# Altium schematic sheet 3_P3.schdoc
size 307 x 218 mm; Symbol: Drawing-Symbol_A4; Device: Drawing-Symbol_A4; Company: 嘉立创EDA; Version: V1.0; Page Size: A4; @Project Name: TUSB4020BPHP; @Page Count: 2; @Update Date: 2025-04-17; @Create Date: 2025-04-13; @Schematic Name: Schematic1; @Page No: 2; @Page Name: P2; @Create Time: 01:15:57; @Update Time: 21:07:25; Width: 1170; Height: 825; Region Start: 1; X Region Count: 6; Y Region Count: 4; Blade Width: 10; Title Block Position: 3; @Board Name: Board1; SheetNumber: 3; SheetTotal: 3
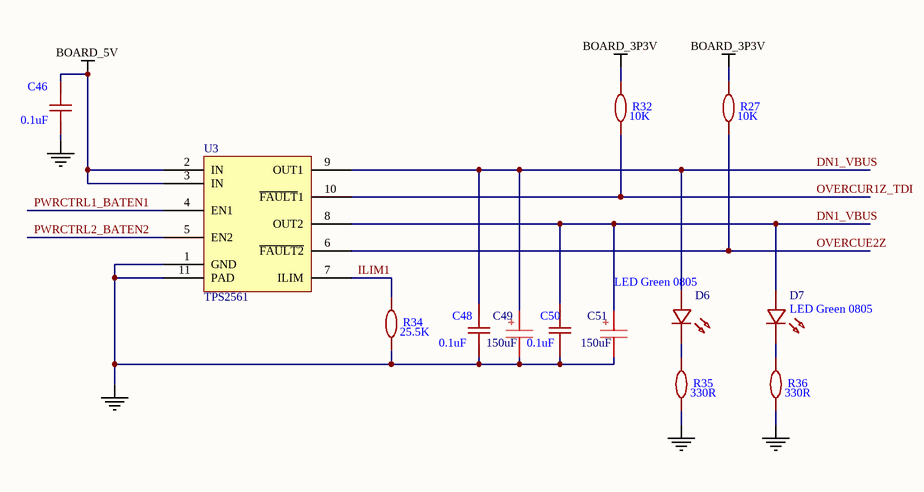
[diagram p0: 3_P3.schdoc]

## Parts
C46  0.1uF  [C0603]
C48  0.1uF  [C0603]
C49  150uF  [C0603]
C50  0.1uF  [C0603]
C51  150uF  [C0603]
D6  LED Green 0805  [LED_0805]
D7  LED Green 0805  [LED_0805]
R27  10K  [R0603]
R32  10K  [R0603]
R34  25.5K  [R0603]
R35  330R  [R0603]
R36  330R  [R0603]
U3  TPS2561  [TI_TPS2561_VSON-10]

## Nets
BOARD_3P3V: R27.2 R32.2
BOARD_5V: C46.2 U3.2(IN) U3.3(IN)
GND: C46.1 C48.1 C49.2 C50.1 C51.2 R34.1 R35.1 R36.1 U3.1(GND) U3.11(PAD)
DN1_VBUS: C48.2 C49.1 C50.2 C51.1 D6.2(A) D7.2(A) U3.8(OUT2) U3.9(OUT1)
ILIM1: R34.2 U3.7(ILIM)
OVERCUE2Z: R27.1 U3.6(~{FAULT2})
OVERCUR1Z_TDI: R32.1 U3.10(~{FAULT}1)
PWRCTRL1_BATEN1: U3.4(EN1)
PWRCTRL2_BATEN2: U3.5(EN2)
NetD6_1: D6.1(C) R35.2
NetD7_1: D7.1(C) R36.2

## Notes on the sheet
- 1
- 2
- 3
- 4
- 5
- 6
- A
- B
- C
- 原理图
- Schematic1
- 创建日期
- 更新日期
- 2025-04-13
- 2025-04-17
- 板子
- 绘制
- Board1
- 图页
- P2
- D
- 审阅
- 版本
- 尺寸
- TUSB4020BPHP
- 页    2    共    2
- V1.0
- A4
- 嘉立创EDA

## Library data of the parts
C46 C48 C50 = CAP_0603: Symbol: CapAcitance; Convert to PCB: yes; Value: 10uF; Device: CAP_0603; Add into BOM: yes; Supplier Footprint: 0603
C49 C51 = CAP
D6 D7 = LED_0805-G: Symbol: LED_G; Convert to PCB: yes; Device: LED_0805-G; Add into BOM: yes; Supplier Footprint: 0805
R27 R32 R34 = Res_0603: Symbol: 电阻; Convert to PCB: yes; Value: 330R; Device: Res_0603; Add into BOM: yes; Supplier Footprint: 0603
R35 R36 = Res_0603: Symbol: 电阻; Convert to PCB: yes; Device: Res_0603; Add into BOM: yes; Supplier Footprint: 0603; Value: 330R